# Altium schematic sheet Sheet1.SchDoc
size 420 x 297 mm; Address1: Address1; Address2: Address2; Address3: Address3; Address4: Address4; DocumentNumber: АБВГ.123456.001 Э3; SheetNumber: 1; Scale: 1:1; DocumentType: Схема электрическая принципиальная; FirstReferrence: АБВГ.123456.001
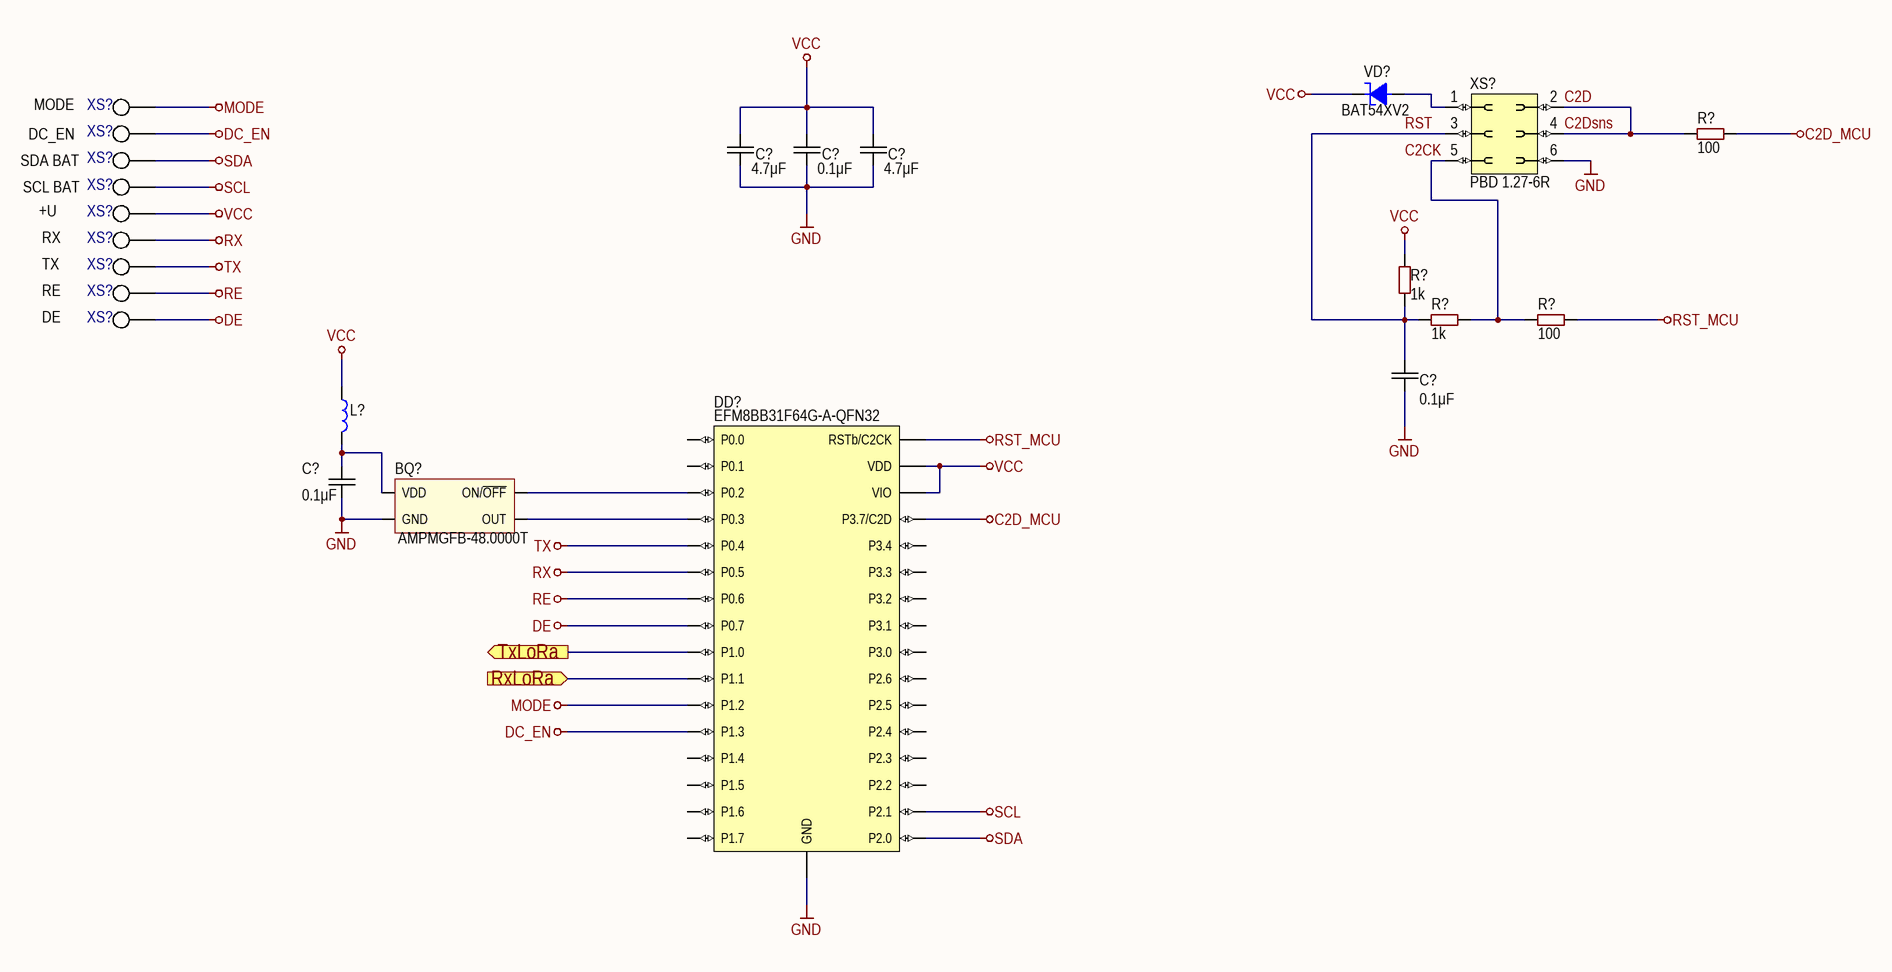
[diagram p0: Sheet1.SchDoc]

## Parts
(Parts that share a designator on the sheet are numbered #1, #2 ... from top to bottom, then left to right.)
BQ?  AMPMGFB-48.0000T  [AMPMGFB(1.6x1.2)]
C?#1  value 4.7μF  [CAP: 0603]
C?#2  value 0.1μF  [CAP: 0603]
C?#3  value 4.7μF  [CAP: 0603]
C?#4  value 0.1μF  [CAP: 0603]
C?#5  value 0.1μF  [CAP: 0603]
DD?  EFM8BB31F64G-A-QFN32  [32-QFN(4x4)]
L?  BLM18AG102SN1D  [IND: 0603]  (value not drawn)
R?#1  value 100  [RES: 0603]
R?#2  value 1k  [RES: 0603]
R?#3  value 1k  [RES: 0603]
R?#4  value 100  [RES: 0603]
VD?  PartNumber: BAT54XV2  [DIODE: SOD523]
XS?#1  Testpoint_HS1mm  [TestPoint(1mm_HS)]  (value not drawn)
XS?#2  PBD 1.27-6R  [CON: PBD1.27-6]
XS?#3  Testpoint_HS1mm  [TestPoint(1mm_HS)]  (value not drawn)
XS?#4  Testpoint_HS1mm  [TestPoint(1mm_HS)]  (value not drawn)
XS?#5  Testpoint_HS1mm  [TestPoint(1mm_HS)]  (value not drawn)
XS?#6  Testpoint_HS1mm  [TestPoint(1mm_HS)]  (value not drawn)
XS?#7  Testpoint_HS1mm  [TestPoint(1mm_HS)]  (value not drawn)
XS?#8  Testpoint_HS1mm  [TestPoint(1mm_HS)]  (value not drawn)
XS?#9  Testpoint_HS1mm  [TestPoint(1mm_HS)]  (value not drawn)
XS?#10  Testpoint_HS1mm  [TestPoint(1mm_HS)]  (value not drawn)

## Ports
RxLoRa (in), TxLoRa (out)

## Nets
C2D_MCU: DD?.5(P3.7/C2D) R?#1.1
DC_EN: DD?.22(P1.3) XS?#3.1
DE: DD?.26(P0.7) XS?#10.1
GND: BQ?.2(GND) C?#1.1 C?#2.1 C?#3.1 C?#4.1 C?#5.1 DD?.0(GND) XS?#2.6
MODE: DD?.23(P1.2) XS?#1.1
RE: DD?.27(P0.6) XS?#9.1
RST_MCU: DD?.4(RSTb/C2CK) R?#4.2
RX: DD?.28(P0.5) XS?#7.1
SCL: DD?.16(P2.1) XS?#5.1
SDA: DD?.17(P2.0) XS?#4.1
TX: DD?.29(P0.4) XS?#8.1
VCC: C?#1.2 C?#2.2 C?#3.2 DD?.2(VIO) DD?.3(VDD) L?.1 R?#2.1 VD?.2 XS?#6.1
C2D: R?#1.2 XS?#2.2 XS?#2.4  [also labelled C2Dsns]
RST: C?#4.2 R?#2.2 R?#3.1 XS?#2.3
RxLoRa: DD?.24(P1.1) ; port RxLoRa
TxLoRa: DD?.25(P1.0) ; port TxLoRa
NetBQ?_1: BQ?.1(ON/~{OFF}) DD?.31(P0.2)
NetBQ?_3: BQ?.3(OUT) DD?.30(P0.3)
NetBQ?_4: BQ?.4(VDD) C?#5.2 L?.2
NetR?#3_2: R?#3.2 R?#4.1 XS?#2.5
NetVD?_1: VD?.1 XS?#2.1

Not connected (* = marked no-connect by the designer): DD? 1(P0.0) 6(P3.4) 7(P3.3) 8(P3.2) 9(P3.1) 10(P3.0) 11(P2.6) 12(P2.5) 13(P2.4) 14(P2.3) 15(P2.2) 18(P1.7) 19(P1.6) 20(P1.5) 21(P1.4) 32(P0.1)

## Notes on the sheet
- (near XS?#4) SDA BAT
- DC_EN
- MODE
- (near XS?#5) SCL BAT
- +U
- RX
- TX
- RE
- DE
- Labels drawn without touching a wire or pin: C2CK
- Перв. примен.
- Справ. №
- Подп. и дата
- Инв. № дубл.
- Взам. инв. №
- Разраб.
- Изм.
- Лист
- № докум.
- Подп.
- Дата
- Лит.
- Масса
- Масштаб
- Пров.
- Т.контр.
- Листов
- Инв. № подл.
- Утв.
- Н.контр.
- 2.106-A3
- Копировал
- Формат А3

## Library data of the parts
C?#1 C?#3 = Ceramic_0603: Manufacturer: Yageo; PartNumber: CC0603KRX7R7BB104; ValueManufacturerPartNumber: Ceramic capacitor, 4.7μF, X7R, ±10%, 16V, 0603, -55...+125°C; TypeCapacitor: Ceramic capacitor; Tolerance: ±10%; TypeDielectric: X7R; Voltage: 16V; Package: 0603; HelpURL: https://www.digikey.com/product-detail/en/yageo/CC0603KRX7R7BB104/311-1088-1-ND/302998; Temperature: -55...+125°C
C?#2 C?#4 C?#5 = Ceramic_0603: Manufacturer: Yageo; PartNumber: CC0603KRX7R7BB104; ValueManufacturerPartNumber: Ceramic capacitor, 0.1μF, X7R, ±10%, 16V, 0603, -55...+125°C; TypeCapacitor: Ceramic capacitor; Tolerance: ±10%; TypeDielectric: X7R; Voltage: 16V; Package: 0603; HelpURL: https://www.digikey.com/product-detail/en/yageo/CC0603KRX7R7BB104/311-1088-1-ND/302998; Temperature: -55...+125°C
DD? = EFM8BB31F64G-A-QFN32: 8051 MCU Core
L? = BLM18AG102SN1D: 100MHz 1K
R?#1 R?#4 = Resistor_0603: Manufacturer: Yageo; PartNumber: RC0603JR-07100RL; ValueManufacturerPartNumber: Resistor film, 100, ±5%, 0603, 0.1W, -55...+125°C; TypeResistor: Resistor film; Power: 0.1W; Tolerance: ±5%; Package: 0603; HelpURL: https://www.digikey.com/product-detail/en/yageo/RC0603JR-07100RL/311-100GRCT-ND/729644; Temperature: -55...+125°C
R?#2 R?#3 = Resistor_0603: Manufacturer: Yageo; PartNumber: RC0603JR-07100RL; ValueManufacturerPartNumber: Resistor film, 1k, ±5%, 0603, 0.1W, -55...+125°C; TypeResistor: Resistor film; Power: 0.1W; Tolerance: ±5%; Package: 0603; HelpURL: https://www.digikey.com/product-detail/en/yageo/RC0603JR-07100RL/311-100GRCT-ND/729644; Temperature: -55...+125°C
VD? = Schottky_single: Manufacturer: Diodes Incorporated; ValueManufacturerPartNumber: Schottky diode, 80V, 500mA, 1V, 15pF, SOD-123, -55...+150°C; TypeDiode: Schottky diode; Voltage: 80V; Current: 500mA; VoltageDrop: 1V; RecoveryTime: 15pF; Package: SOD-123; HelpURL: https://www.digikey.com/product-detail/en/diodes-incorporated/MBR0580S1-7/MBR0580S1-7DICT-ND/5080371; Temperature: -55...+150°C